# EAGLE design %_parasit (EAGLE 7.3.0)
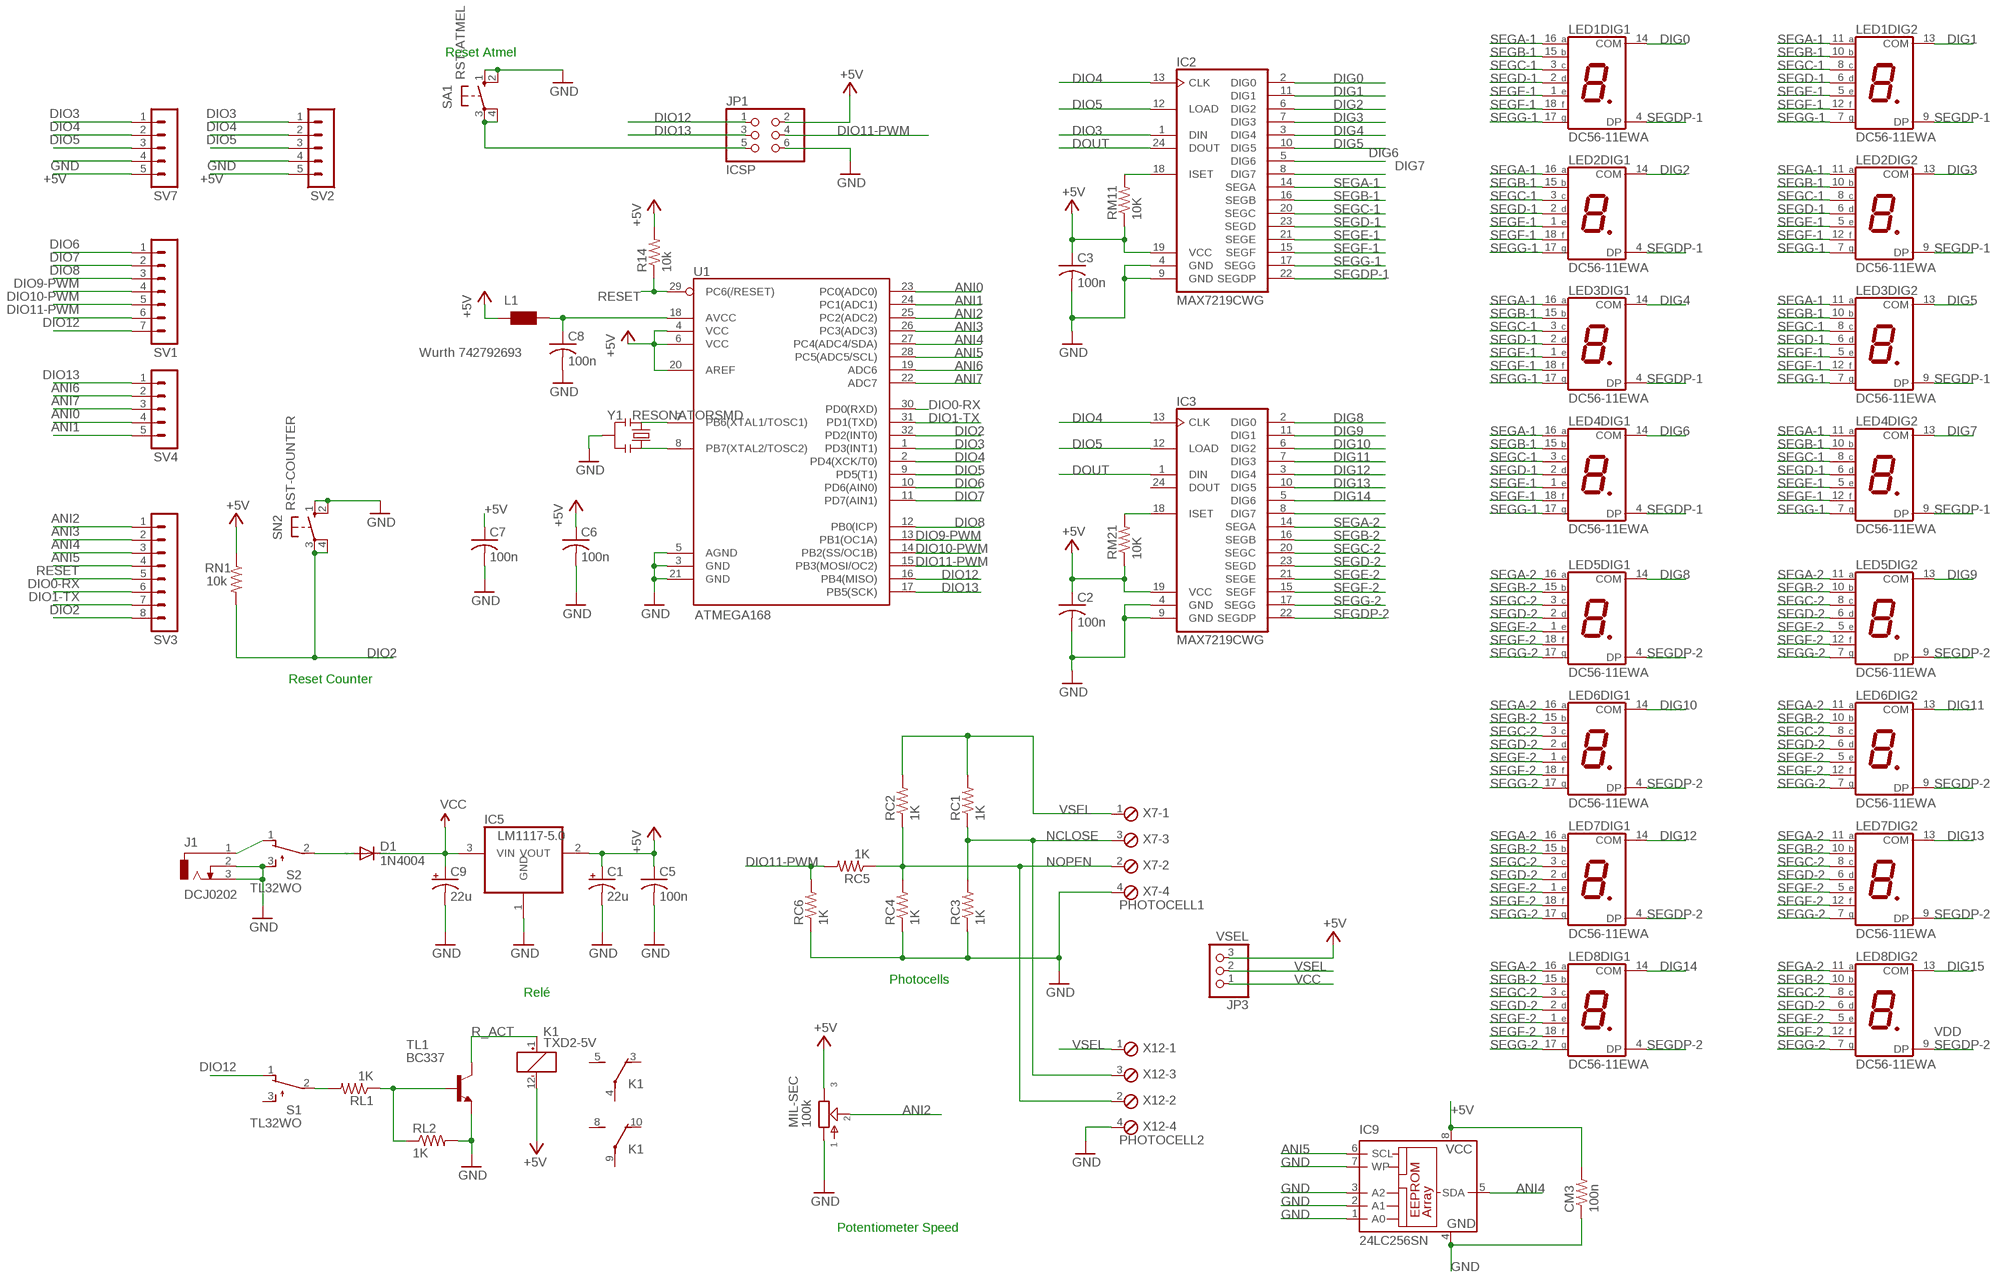
[diagram p0: schematic, sheet 1]

## Parts
C1  22u  CPOL-USC  [PANASONIC_C]
C2  100n  C-USC0603  [C0603]
C3  100n  C-USC0603  [C0603]
C5  100n  C-USC0603  [C0603]
C6  100n  C-USC0603  [C0603]
C7  100n  C-USC0603  [C0603]
C8  100n  C-USC0603  [C0603]
C9  22u  CPOL-USC  [PANASONIC_C]
CM3  100n  R-US_R0603  [R0603]
D1  1N4004  [DO41-10]
IC2  MAX7219CWG  [SO24W]
IC3  MAX7219CWG  [SO24W]
IC5  LM1117-5.0  REG1117  [SOT223]
IC9  24LC256SN  [SO-08]
J1  DCJ0202  [DCJ0202]
JP1  ICSP  PINHD-2X3  [2X03]
JP3  VSEL  PINHD-1X3  [1X03]
K1  TXD2-5V  [TXD2]
L1  WE-CBF_0603  [0603]
LED1  DC56-11EWA  [DA56]
LED2  DC56-11EWA  [DA56]
LED3  DC56-11EWA  [DA56]
LED4  DC56-11EWA  [DA56]
LED5  DC56-11EWA  [DA56]
LED6  DC56-11EWA  [DA56]
LED7  DC56-11EWA  [DA56]
LED8  DC56-11EWA  [DA56]
MIL-SEC  100k  16MM-PCB-BRACKETS  [16MM-PCB-BRACKETS@1]
R14  10k  R-US_R0603  [R0603]
RC1  1K  R-US_R0603  [R0603]
RC2  1K  R-US_R0603  [R0603]
RC3  1K  R-US_R0603  [R0603]
RC4  1K  R-US_R0603  [R0603]
RC5  1K  R-US_R0603  [R0603]
RC6  1K  R-US_R0603  [R0603]
RL1  1K  R-US_R0603  [R0603]
RL2  1K  R-US_R0603  [R0603]
RM11  10K  R-US_R0603  [R0603]
RM21  10K  R-US_R0603  [R0603]
RN1  10k  R-US_R0603  [R0603]
S1  TL32WO  [TL3XWO]
S2  TL32WO  [TL3XWO]
SA1  RST-ATMEL  10-XX  [B3F-10XX]
SN2  RST-COUNTER  10-XX  [B3F-10XX]
SV1  MA07-1  [MA07-1]
SV2  MA05-1  [MA05-1]
SV3  MA08-1  [MA08-1]
SV4  MA05-1  [MA05-1]
SV7  MA05-1  [MA05-1]
TL1  BC337  [TO92]
U1  ATMEGA168  [TQFP32-08]
X7  PHOTOCELL1  MPT4  [4POL254]
X12  PHOTOCELL2  MPT4  [4POL254]
Y1  RESONATORSMD  [RESONATOR-SMD]

## Nets
+5V [Power]: C1.+ C2.1 C3.1 C5.1 C6.1 C7.1 CM3.2 IC2.19(VCC) IC3.19(VCC) IC5.2(VOUT) IC9.8(VCC) JP1.2 JP3.3 K1.12(_:-) L1.1 MIL-SEC.3 R14.2 RM11.1 RM21.1 RN1.1 SV2.5 SV7.5 U1.4(VCC) U1.6(VCC) U1.20(AREF)
ANI0: SV4.4 U1.23(PC0(ADC0))
ANI1: SV4.5 U1.24(PC1(ADC1))
ANI2: MIL-SEC.2 SV3.1 U1.25(PC2(ADC2))
ANI3: SV3.2 U1.26(PC3(ADC3))
ANI4: IC9.5(SDA) SV3.3 U1.27(PC4(ADC4/SDA))
ANI5: IC9.6(SCL) SV3.4 U1.28(PC5(ADC5/SCL))
ANI6: SV4.2 U1.19(ADC6)
ANI7: SV4.3 U1.22(ADC7)
DIG0 [Leds]: IC2.2(DIG0) LED1.14(DIG1:COM)
DIG1 [Leds]: IC2.11(DIG1) LED1.13(DIG2:COM)
DIG2 [Leds]: IC2.6(DIG2) LED2.14(DIG1:COM)
DIG3 [Leds]: IC2.7(DIG3) LED2.13(DIG2:COM)
DIG4 [Leds]: IC2.3(DIG4) LED3.14(DIG1:COM)
DIG5 [Leds]: IC2.10(DIG5) LED3.13(DIG2:COM)
DIG6 [Leds]: IC2.5(DIG6) LED4.14(DIG1:COM)
DIG7 [Leds]: IC2.8(DIG7) LED4.13(DIG2:COM)
DIG8 [Leds]: IC3.2(DIG0) LED5.14(DIG1:COM)
DIG9 [Leds]: IC3.11(DIG1) LED5.13(DIG2:COM)
DIG10 [Leds]: IC3.6(DIG2) LED6.14(DIG1:COM)
DIG11 [Leds]: IC3.7(DIG3) LED6.13(DIG2:COM)
DIG12 [Leds]: IC3.3(DIG4) LED7.14(DIG1:COM)
DIG13 [Leds]: IC3.10(DIG5) LED7.13(DIG2:COM)
DIG14: IC3.5(DIG6) LED8.14(DIG1:COM)
DIG15: IC3.8(DIG7) LED8.13(DIG2:COM)
DIO0-RX: SV3.6 U1.30(PD0(RXD))
DIO1-TX: SV3.7 U1.31(PD1(TXD))
DIO2: RN1.2 SN2.3(P) SN2.4(P1) SV3.8 U1.32(PD2(INT0))
DIO3: IC2.1(DIN) SV2.1 SV7.1 U1.1(PD3(INT1))
DIO4: IC2.13(CLK) IC3.13(CLK) SV2.2 SV7.2 U1.2(PD4(XCK/T0))
DIO5: IC2.12(LOAD) IC3.12(LOAD) SV2.3 SV7.3 U1.9(PD5(T1))
DIO6: SV1.1 U1.10(PD6(AIN0))
DIO7: SV1.2 U1.11(PD7(AIN1))
DIO8: SV1.3 U1.12(PB0(ICP))
DIO9-PWM: SV1.4 U1.13(PB1(OC1A))
DIO10-PWM: SV1.5 U1.14(PB2(SS/OC1B))
DIO11-PWM: JP1.4 RC5.2 RC6.2 SV1.6 U1.15(PB3(MOSI/OC2))
DIO12: JP1.1 S1.1(O) SV1.7 U1.16(PB4(MISO))
DIO13: JP1.3 SV4.1 U1.17(PB5(SCK))
DOUT: IC2.24(DOUT) IC3.1(DIN)
GND: C1.- C2.2 C3.2 C5.2 C6.2 C7.2 C8.2 C9.- CM3.1 IC2.4(GND) IC2.9(GND) IC3.4(GND) IC3.9(GND) IC5.1(GND) IC9.1(A0) IC9.2(A1) IC9.3(A2) IC9.4(GND) IC9.7(WP) J1.2 J1.3 JP1.6 MIL-SEC.1 RC3.1 RC4.1 RC6.1 RL2.2 S2.3(S) SA1.1(S) SA1.2(S1) SN2.1(S) SN2.2(S1) SV2.4 SV7.4 TL1.1(E) U1.3(GND) U1.5(AGND) U1.21(GND) X7.4 X12.4 Y1.2
N$1: J1.1 S2.1(O)
N$2: D1.A S2.2(P)
N$4: RL1.2 S1.2(P)
N$8: RL1.1 RL2.1 TL1.2(B)
N$9: U1.7(PB6(XTAL1/TOSC1)) Y1.1
N$10: IC2.18(ISET) RM11.2
N$11: IC3.18(ISET) RM21.2
N$12: U1.8(PB7(XTAL2/TOSC2)) Y1.3
N$39: C8.1 L1.2 U1.18(AVCC)
NCLOSE: RC1.1 RC3.2 X7.3 X12.3
NOPEN: RC2.1 RC4.2 RC5.1 X7.2 X12.2
R_ACT: K1.1(_:+) TL1.3(C)
RESET: JP1.5 R14.1 SA1.3(P) SA1.4(P1) SV3.5 U1.29(PC6(/RESET))
SEGA-1: IC2.14(SEGA) LED1.11(DIG2:A) LED1.16(DIG1:A) LED2.11(DIG2:A) LED2.16(DIG1:A) LED3.11(DIG2:A) LED3.16(DIG1:A) LED4.11(DIG2:A) LED4.16(DIG1:A)
SEGA-2: IC3.14(SEGA) LED5.11(DIG2:A) LED5.16(DIG1:A) LED6.11(DIG2:A) LED6.16(DIG1:A) LED7.11(DIG2:A) LED7.16(DIG1:A) LED8.11(DIG2:A) LED8.16(DIG1:A)
SEGB-1: IC2.16(SEGB) LED1.10(DIG2:B) LED1.15(DIG1:B) LED2.10(DIG2:B) LED2.15(DIG1:B) LED3.10(DIG2:B) LED3.15(DIG1:B) LED4.10(DIG2:B) LED4.15(DIG1:B)
SEGB-2: IC3.16(SEGB) LED5.10(DIG2:B) LED5.15(DIG1:B) LED6.10(DIG2:B) LED6.15(DIG1:B) LED7.10(DIG2:B) LED7.15(DIG1:B) LED8.10(DIG2:B) LED8.15(DIG1:B)
SEGC-1: IC2.20(SEGC) LED1.3(DIG1:C) LED1.8(DIG2:C) LED2.3(DIG1:C) LED2.8(DIG2:C) LED3.3(DIG1:C) LED3.8(DIG2:C) LED4.3(DIG1:C) LED4.8(DIG2:C)
SEGC-2: IC3.20(SEGC) LED5.3(DIG1:C) LED5.8(DIG2:C) LED6.3(DIG1:C) LED6.8(DIG2:C) LED7.3(DIG1:C) LED7.8(DIG2:C) LED8.3(DIG1:C) LED8.8(DIG2:C)
SEGD-1: IC2.23(SEGD) LED1.2(DIG1:D) LED1.6(DIG2:D) LED2.2(DIG1:D) LED2.6(DIG2:D) LED3.2(DIG1:D) LED3.6(DIG2:D) LED4.2(DIG1:D) LED4.6(DIG2:D)
SEGD-2: IC3.23(SEGD) LED5.2(DIG1:D) LED5.6(DIG2:D) LED6.2(DIG1:D) LED6.6(DIG2:D) LED7.2(DIG1:D) LED7.6(DIG2:D) LED8.2(DIG1:D) LED8.6(DIG2:D)
SEGDP-1: IC2.22(SEGDP) LED1.4(DIG1:DP) LED1.9(DIG2:DP) LED2.4(DIG1:DP) LED2.9(DIG2:DP) LED3.4(DIG1:DP) LED3.9(DIG2:DP) LED4.4(DIG1:DP) LED4.9(DIG2:DP)
SEGDP-2: IC3.22(SEGDP) LED5.4(DIG1:DP) LED5.9(DIG2:DP) LED6.4(DIG1:DP) LED6.9(DIG2:DP) LED7.4(DIG1:DP) LED7.9(DIG2:DP) LED8.4(DIG1:DP) LED8.9(DIG2:DP)
SEGE-1: IC2.21(SEGE) LED1.1(DIG1:E) LED1.5(DIG2:E) LED2.1(DIG1:E) LED2.5(DIG2:E) LED3.1(DIG1:E) LED3.5(DIG2:E) LED4.1(DIG1:E) LED4.5(DIG2:E)
SEGE-2: IC3.21(SEGE) LED5.1(DIG1:E) LED5.5(DIG2:E) LED6.1(DIG1:E) LED6.5(DIG2:E) LED7.1(DIG1:E) LED7.5(DIG2:E) LED8.1(DIG1:E) LED8.5(DIG2:E)
SEGF-1: IC2.15(SEGF) LED1.12(DIG2:F) LED1.18(DIG1:F) LED2.12(DIG2:F) LED2.18(DIG1:F) LED3.12(DIG2:F) LED3.18(DIG1:F) LED4.12(DIG2:F) LED4.18(DIG1:F)
SEGF-2: IC3.15(SEGF) LED5.12(DIG2:F) LED5.18(DIG1:F) LED6.12(DIG2:F) LED6.18(DIG1:F) LED7.12(DIG2:F) LED7.18(DIG1:F) LED8.12(DIG2:F) LED8.18(DIG1:F)
SEGG-1: IC2.17(SEGG) LED1.7(DIG2:G) LED1.17(DIG1:G) LED2.7(DIG2:G) LED2.17(DIG1:G) LED3.7(DIG2:G) LED3.17(DIG1:G) LED4.7(DIG2:G) LED4.17(DIG1:G)
SEGG-2: IC3.17(SEGG) LED5.7(DIG2:G) LED5.17(DIG1:G) LED6.7(DIG2:G) LED6.17(DIG1:G) LED7.7(DIG2:G) LED7.17(DIG1:G) LED8.7(DIG2:G) LED8.17(DIG1:G)
VCC: C9.+ D1.C IC5.3(VIN) JP3.1
VSEL: JP3.2 RC1.2 RC2.2 X7.1 X12.1
Unconnected: IC3.24(DOUT) K1.3(O) K1.4(P) K1.5(S) K1.8(S) K1.9(P) K1.10(O) S1.3(S)

## Notes on the sheet
- Reset Atmel
- Wurth 742792693
- Reset Counter
- Photocells
- Relé
- Potentiometer Speed

## Library data of the parts
C1 C9 = rcl:CPOL-US: POLARIZED CAPACITOR, American symbol
C2 C3 C5-C8 = rcl:C-US: CAPACITOR, American symbol
CM3 RC6 RL1 RL2 = resistor:R-US_: RESISTOR, American symbol
D1 = diode:1N4004: DIODE general purpose rectifier, 1 A
IC2 IC3 = maxim-5:MAX7219*: Serially Interfaced, 8-Digit LED Display Drivers
IC5 = og-vreg:REG1117: 800mA and 1A Low Dropout (LDO) Positive Regulator 1.8V, 2.5V, 2.85V, 3.3V, 5V, and Adj
IC9 = microchip:24*: Serial EEPROM I2C; MF: MICROCHIP; MPN: 24LC256-I/SN; OC_FARNELL: 9757996; OC_NEWARK: 27C9144
J1 = con-jack:DCJ0202: DC POWER JACK Source: DCJ0202.pdf; OC_FARNELL: unknown; OC_NEWARK: unknown
JP1 = pinhead:PINHD-2X3: PIN HEADER
JP3 = pinhead:PINHD-1X3: PIN HEADER
K1 = relay:TX?-*: TX Relais NAiS TX-D RELAYS HIGH INSULATION Conforming to the supplementary insulation class of EN Standards (EN41003) Source: http://www.mew-europe.com/.. en_ds_61022_0007.pdf TX-S RELAYS SMALL POLARIZED RELAY WITH HIGH SENSITIVITY 50mW Source: http://www.mew-europe.com/.. en_ds_61022_0022.pdf; MPN: TXD2-5V; OC_FARNELL: unknown; OC_NEWARK: 13P9525
L1 = wuerth-elektronik:WE-CBF: SMD EMI Suppression Ferrite Beads - excellent anti-EMI properties - low DCR - impedances till 3000 ohms - rated current up to 6 A
LED1-LED8 = display-kingbright:DC56-11: 14.22mm (0.56INCH) DUAL DIGIT NUMERIC DISPLAYS Source: www.kingbright.com .. DA56-11SRWA.pdf; OC_FARNELL: unknown; OC_NEWARK: unknown
MIL-SEC = gm-pots:16MM-PCB-BRACKETS
R14 RC1-RC5 RM11 RM21 RN1 = rcl:R-US_: RESISTOR, American symbol
S1 S2 = switch:TL32WO: TINY SWITCH ON - MOM Source: http://www2.produktinfo.conrad.com/datenblaetter/700000-724999/705152-da-01-de-Subminiaturschalter_TL_36WO.pdf
SA1 SN2 = switch-omron:10-XX: OMRON SWITCH; MPN: B3F-1000; OC_FARNELL: 176432; OC_NEWARK: 36M3542
SV1 = con-lstb:MA07-1: PIN HEADER; OC_FARNELL: unknown; OC_NEWARK: unknown
SV2 SV4 SV7 = con-lstb:MA05-1: PIN HEADER; OC_FARNELL: unknown; OC_NEWARK: unknown
SV3 = con-lstb:MA08-1: PIN HEADER; OC_FARNELL: unknown; OC_NEWARK: unknown
TL1 = transistor:BC337: NPN TRANSISTOR
U1 = SparkFun:ATMEGA168
X7 X12 = con-phoenix-254:MPT4: PHOENIX CONNECTOR; OC_FARNELL: unknown; OC_NEWARK: unknown
Y1 = SparkFun:RESONATOR: Resonator Small SMD resonator. This is the itty bitty 10/20MHz resonators with built in caps. CSTCE10M0G55 and CSTCE20M0V53. Footprint has been reviewed closely but hasn't been tested yet.

## Net classes
1 Leds: width 0.152 mm, drill 0.508 mm, clearance 0.203 mm
2 Power: width 0.152 mm, drill 0.508 mm, clearance 0.203 mm
3 Ground Plane: width 0.152 mm, drill 0.508 mm, clearance 0.203 mm

## Board
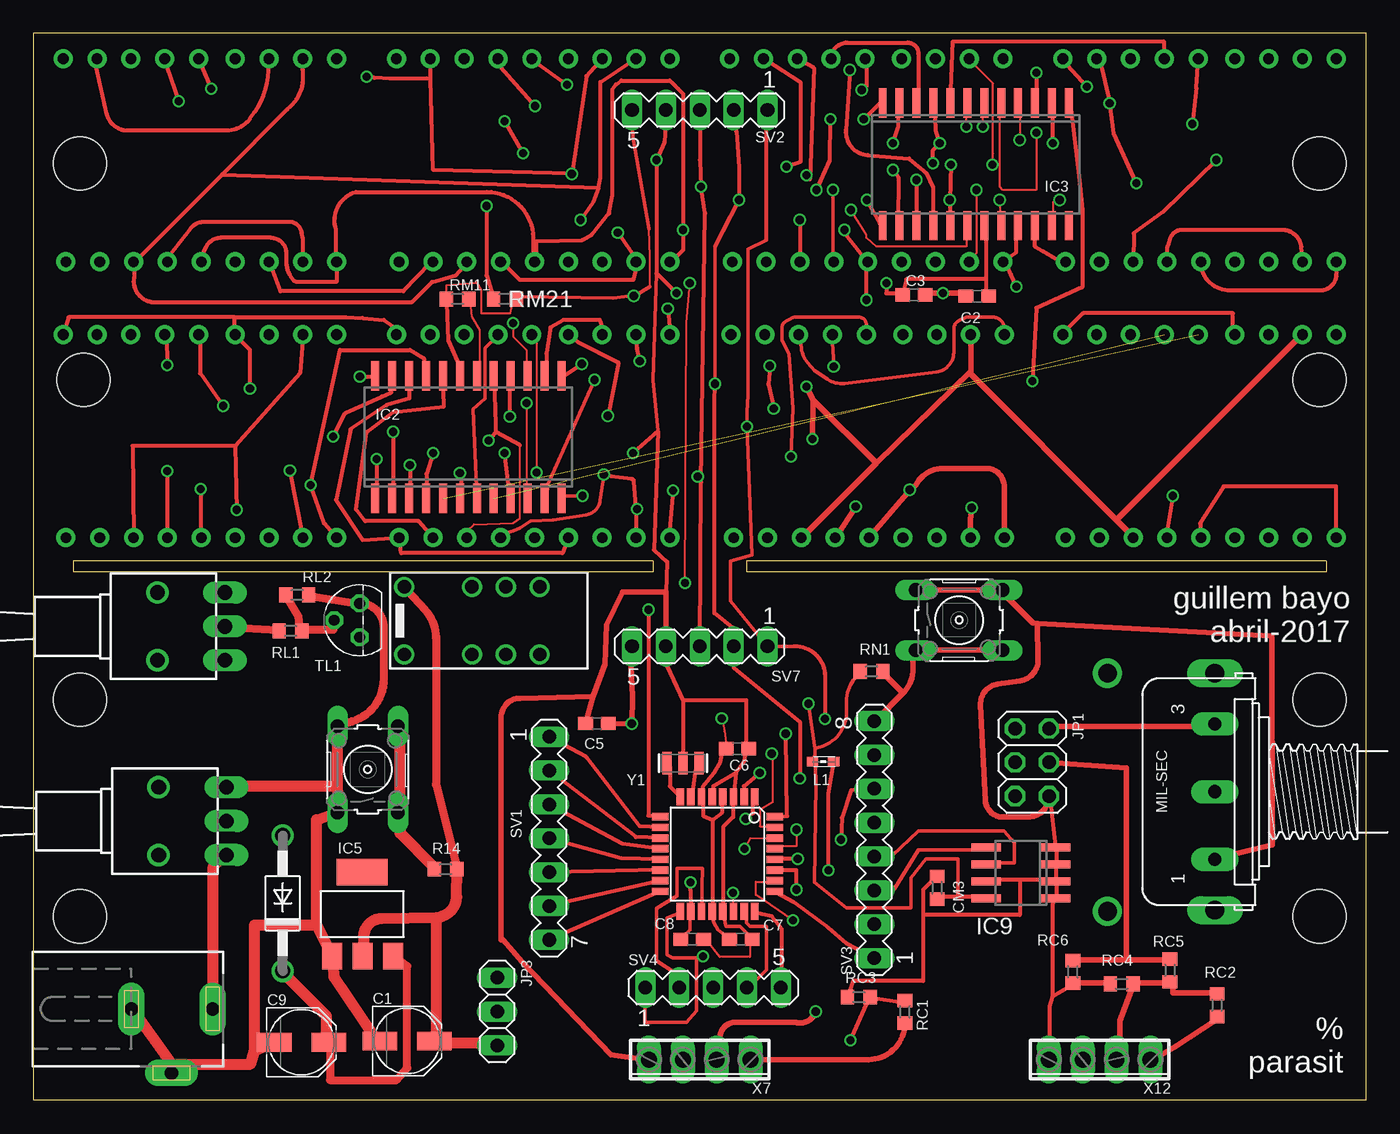
[diagram p1: board, top side]
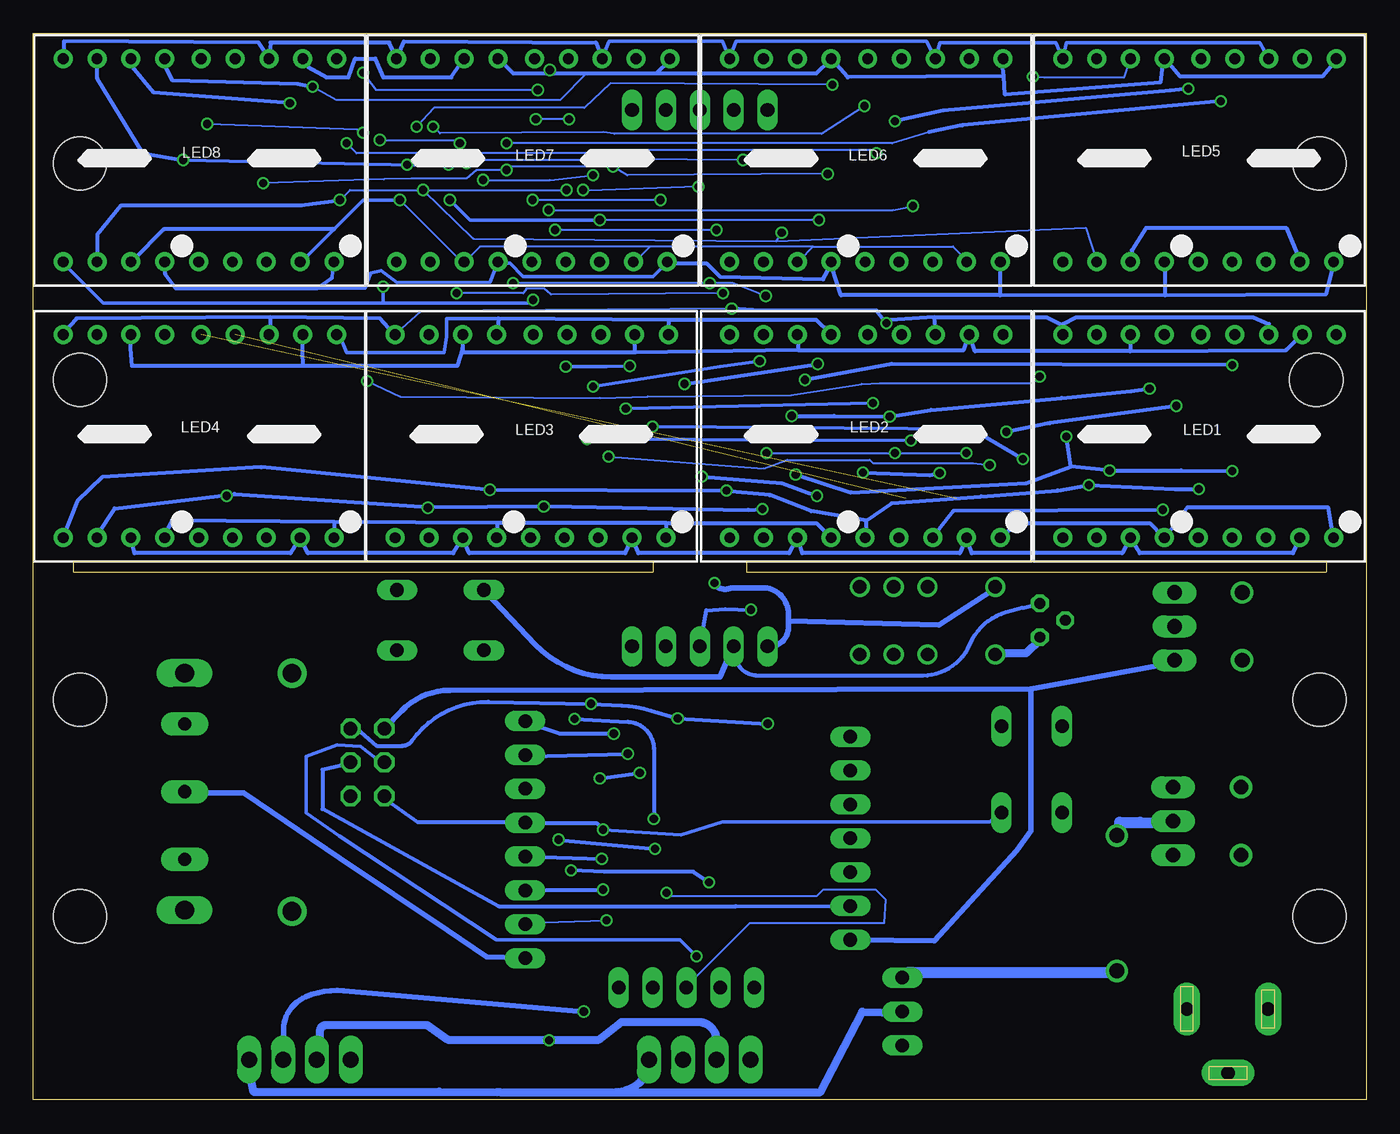
[diagram p2: board, bottom side, seen from below]

Size 100 x 80 mm. Coordinates in mm from the lower left corner, seen from the top.
Outline: 0,0 100,0 100,80 0,80 0,0
Outline: 46.5,39.6 3,39.6 3,40.4 46.5,40.4 46.5,39.6
Outline: 97,39.6 53.5,39.6 53.5,40.4 97,40.4 97,39.6
Copper layers (1*16): Top 0.035mm / dielectric 1.5mm / Bottom 0.035mm
Design rules "default *": minimum track width 6mil, minimum drill 24mil, track to track 8mil, track to pad 8mil, pad to pad 8mil, via to via 8mil, smd to smd 8mil, copper to edge 40mil, drill to drill 8mil, minimum pad ring 10mil, minimum via ring 4mil, stop-mask expansion 4mil, vias tented up to drill 0mil, thermal gap 10mil
Holes 4 mm at 3.5,70.25 96.5,70.25 3.75,54 96.5,54 3.5,13.75 96.5,13.75 96.5,30 3.5,30

### Footprints (pad centres in the part's own frame; a part is rotated, then mirrored left to right if it is on the bottom)
PANASONIC_C = smd 2.6 x 1.4: + 2.05,0; - -2.05,0
C0603 = smd 1.1 x 1: 1 -0.85,0; 2 0.85,0
R0603 = smd 1 x 1.1: 1 -0.85,0; 2 0.85,0
DO41-10 = drill 1.118: A 5.08,0; C -5.08,0
SO24W = smd 0.6 x 2.2: 1 -6.985,-4.6; 2 -5.715,-4.6; 3 -4.445,-4.6; 4 -3.175,-4.6; 5 -1.905,-4.6; 6 -0.635,-4.6; 7 0.635,-4.6; 8 1.905,-4.6; 9 3.175,-4.6; 10 4.445,-4.6; 11 5.715,-4.6; 12 6.985,-4.6; 13 6.985,4.6; 14 5.715,4.6; 15 4.445,4.6; 16 3.175,4.6; 17 1.905,4.6; 18 0.635,4.6; 19 -0.635,4.6; 20 -1.905,4.6; 21 -3.175,4.6; 22 -4.445,4.6; 23 -5.715,4.6; 24 -6.985,4.6
SOT223 = smd 1.499 x 2.007: 1 -2.261,-3.15; 2 0.025,-3.15; 3 2.311,-3.15 | smd 3.81 x 2.007: 4 0,3.15
SO-08 = smd 0.6 x 2.2: 1 -1.905,-2.6; 2 -0.635,-2.6; 3 0.635,-2.6; 4 1.905,-2.6; 5 1.905,2.6; 6 0.635,2.6; 7 -0.635,2.6; 8 -1.905,2.6
DCJ0202 = drill 1 pad 2 long: 1 0,3.1; 2 4.8,0; 3 0,-3
2X03 = drill 1.016 octagon: 1 -2.54,-1.27; 2 -2.54,1.27; 3 0,-1.27; 4 0,1.27; 5 2.54,-1.27; 6 2.54,1.27
1X03 = drill 1.016 long: 1 -2.54,0; 2 0,0; 3 2.54,0
TXD2 = drill 1: 1 -6.35,-2.54; 3 -1.27,-2.54; 4 1.27,-2.54; 5 3.81,-2.54; 8 3.81,2.54; 9 1.27,2.54; 10 -1.27,2.54; 12 -6.35,2.54
0603 = smd 0.85 x 0.7: 1 -0.9,0; 2 0.7,0
DA56 = drill 0.8 pad 1.422: 1 -10.26,-7.62; 2 -7.72,-7.62; 3 -5.18,-7.62; 4 -2.64,-7.62; 5 -0.1,-7.62; 6 2.44,-7.62; 7 4.98,-7.62; 8 7.52,-7.62; 9 10.06,-7.62; 10 10.26,7.62; 11 7.72,7.62; 12 5.18,7.62; 13 2.64,7.62; 14 0.1,7.62; 15 -2.64,7.62; 16 -5.18,7.62; 17 -7.72,7.62; 18 -10.26,7.62
16MM-PCB-BRACKETS@1 = drill 1 pad 1.778 long: 1 5.08,-0.254; 2 0,-0.254; 3 -5.08,-0.254 | drill 1.4 pad 1.778 long: 4 -8.89,-0.254; 5 8.89,-0.254 | drill 1.4 pad 2.184: 6 -8.89,-8.31; 7 8.983,-8.31
TL3XWO = drill 1.1 pad 1.422 long: 1 -2.54,-5.08; 2 0,-5.08; 3 2.54,-5.08 | drill 1.1 pad 1.676: M1 -2.54,0; M2 2.54,0
B3F-10XX = drill 1.016 long: 1 -3.251,2.261; 2 3.251,2.261; 3 -3.251,-2.261; 4 3.251,-2.261
MA07-1 = drill 1.016 long: 1 -7.62,0; 2 -5.08,0; 3 -2.54,0; 4 0,0; 5 2.54,0; 6 5.08,0; 7 7.62,0
MA05-1 = drill 1.016 long: 1 -5.08,0; 2 -2.54,0; 3 0,0; 4 2.54,0; 5 5.08,0
MA08-1 = drill 1.016 long: 1 -8.89,0; 2 -6.35,0; 3 -3.81,0; 4 -1.27,0; 5 1.27,0; 6 3.81,0; 7 6.35,0; 8 8.89,0
TO92 = drill 0.813 octagon: 1 1.27,0; 2 0,1.905; 3 -1.27,0
TQFP32-08 = smd 1.27 x 0.559: 1 -4.293,2.8; 2 -4.293,2; 3 -4.293,1.2; 4 -4.293,0.4; 5 -4.293,-0.4; 6 -4.293,-1.2; 7 -4.293,-2; 8 -4.293,-2.8; 17 4.293,-2.8; 18 4.293,-2; 19 4.293,-1.2; 20 4.293,-0.4; 21 4.293,0.4; 22 4.293,1.2; 23 4.293,2; 24 4.293,2.8 | smd 0.559 x 1.27: 9 -2.8,-4.293; 10 -2,-4.293; 11 -1.2,-4.293; 12 -0.4,-4.293; 13 0.4,-4.293; 14 1.2,-4.293; 15 2,-4.293; 16 2.8,-4.293; 25 2.8,4.293; 26 2,4.293; 27 1.2,4.293; 28 0.4,4.293; 29 -0.4,4.293; 30 -1.2,4.293; 31 -2,4.293; 32 -2.8,4.293
4POL254 = drill 1.2 long: 1 -3.81,0; 2 -1.27,0; 3 1.27,0; 4 3.81,0
RESONATOR-SMD = smd 0.7 x 1.7: 1 -1.2,0; 2 0,0; 3 1.2,0

### Placement (x,y rotation side)
C1  28.04,4.4 0 top
C2  70.82,60.28 180 top
C3  66.07,60.38 0 top
C5  42.28,28.22 180 top
C6  52.83,26.32 0 top
C7  53.08,12.02 0 top
C8  49.43,12.02 0 top
C9  20.12,4.3 0 top
CM3  67.8,15.9 270 top
D1  18.71,14.73 90 top
IC2  32.64,49.71 0 top
IC3  70.71,70.17 180 top
IC5  24.67,13.91 0 top
IC9  74.1,17 90 top
J1  10.36,6.8 270 top
JP1  74.93,25.3 270 top
JP3  34.8,6.6 270 top
K1  34.18,35.93 0 top
L1  59.35,25.34 0 top
LED1  12.5,49.77 0 bottom
LED2  37.5,49.77 0 bottom
LED3  62.6,49.77 0 bottom
LED4  87.5,49.77 0 bottom
LED5  12.5,70.47 0 bottom
LED6  37.5,70.47 0 bottom
LED7  62.5,70.47 0 bottom
LED8  87.5,70.47 0 bottom
MIL-SEC  88.9,23.1 270 top
R14  30.93,17.28 0 top
RC1  65.39,6.58 270 top
RC2  88.81,7.08 270 top
RC3  61.93,7.68 0 top
RC4  81.65,8.68 0 top
RC5  85.27,9.68 90 top
RC6  77.99,9.58 90 top
RL1  19.29,35.16 180 top
RL2  19.81,37.86 0 top
RM11  31.83,60.06 0 top
RM21  35.38,60.06 180 top
RN1  62.89,32.12 0 top
S1  9.3,35.5 90 top
S2  9.4,20.89 90 top
SA1  25.09,24.77 90 top
SN2  69.46,35.97 0 top
SV1  38.7,19.6 270 top
SV2  50,74.25 180 top
SV3  63.1,19.5 90 top
SV4  51,8.4 0 top
SV7  50,34 180 top
TL1  24.48,35.96 90 top
U1  51.33,18.42 270 top
X7  50,3 180 top
X12  80,3 180 top
Y1  48.74,25.24 180 top

### Tracks (layer width: path | path; a pad name or v marks a point on that pad's centre or on a via)
+5V  (via drill 0.61)
  Top 0.152: 71.5,60.5 C2.1 | 71.45,65.6 IC3.19 | 65.25,60.5 C3.1 65,60.5 | 31.05,59.75 31,60 RM11.1 31,60.25 31,61.1 33.25,61.3 33.6,60.75 33.6,59 35.8,59 36,60 RM21.1 36.25,60.25 | 32,55 32,54.5 IC2.19 | 46.2,65.3 46.25,63.25 46.25,61 | 30.25,4.5 C1.+ 30.5,4.25 | 24.75,11 IC5.2 | 44.75,34 SV7.5 | 31.75,17.5 R14.2 | 69.35,15.3 68,15.25 CM3.2 | 71.5,15.25 IC9.8 | 51.75,26.25 C6.1 52,26.5 51.85,27.65 v51.65,28.6 | 50.25,22.75 U1.6 50.25,22.5 | 50.95,14.25 U1.20 51,14 | 51.7,22.5 U1.4 | 76.25,28 JP1.2 | 58.65,26.3 58.65,26.35 L1.1 | v49.25,61.25 49,58.3 v48.9,38.75 | 52,12.25 C7.1 | 62,32 RN1.1 | 34.75,4.25 JP3.3
  Top 0.254: 46.2,65.3 45,72.15 44.9,73.45 SV2.5 | 45.2,60.35 43.5,60.15 36.25,60.25 | 45.2,60.35 46.25,61 | 45.2,60.35 v45.05,60.3 | 69.35,15.3 69.35,18.05 66.95,18.05 65.85,16.65 65.85,14.4 61,14.4 58.6,16.3 58.7,23.7 58.65,26.35 59.06,26.46 arc75 61,29.02 61,29.89 arc-42 61.68,31.64 62,32 | v58.15,29.7 58.65,26.3 | 52,12.25 51.35,12.75 51.05,13.25 51,13.5 51,14
  Top 0.305: 71.5,60.5 71.45,60.75 71.45,61.55 | 71.45,65.6 71.45,61.55 | 65.25,60.5 65.5,61.55 71.45,61.55 | 31.05,59.75 31.15,56.95 32,55 | 65,60.5 64,60.5 v64,61.25 | 68,15.25 71.5,15.25 | 51.75,26.25 51.55,25.35 51.05,24.5 50.25,23.5 50.25,22.75 | 50.95,21 50.25,21.3 50.25,22.5 | 50.95,21 50.95,14.25 | 51.7,22.5 51.7,21.55 50.95,21
  Top 0.406: 44.75,34 44.95,30.3 v44.9,28.2 C5.1 | 76.25,28 88.5,28 MIL-SEC.3
  Top 0.61: 31.75,17.5 30.21,23.62 arc-14 30.2,23.68 30.2,34.67 arc43 29.4,36.72 28,38.25 K1.12
  Top 0.813: 30.25,13.65 30.63,13.75 arc75 31.76,15.21 R14.2 | 30.25,4.5 30.25,13.65 | 30.25,13.65 26.13,13.57 arc88 24.77,12.22 24.75,11 | 30.5,4.25 34.75,4.25
  Bottom 0.152: v64,61.25 v49.25,61.25 47.5,61.25 v45.05,60.3 | 28,38.25 K1.12 | 76,27.75 JP1.2
  Bottom 0.305: 76,27.75 75.75,27.85 74.25,26.55 72.31,26.55 arc-55 71.59,26.92 arc56 65.86,29.84 v58.15,29.7 55.86,29.57 arc13 53.68,29.19 v51.65,28.6 v44.9,28.2
  Bottom 0.406: 28,38.25 32.05,35.6 43.35,35.9 | SV7.5 44.75,34 arc-90 43.35,35.4 43.35,35.9 | 43.35,35.9 43.35,36.45 arc-90 45.3,38.4 47.65,38.4 arc90 v48.9,38.75
ANI0
  Top 0.152: 53.5,14 U1.23
  Top 0.254: 53.5,14 53.5,13.25 53.75,13 55,13 55,9.75 53.75,8.5 SV4.4
ANI1
  Top 0.152: 54.25,14 U1.24
  Top 0.305: 54.25,14 54.7,13.9 55.4,13.75 56.15,12.8 56.15,9.35 56.1,8.5 SV4.5
ANI2
  Top 0.152: 55.75,15.5 U1.25
  Top 0.305: 55.75,15.5 57.05,14.8 59.65,12.9 61.05,11.7 62.8,10.75
  Top 0.406: 62.8,10.75 SV3.1
  Bottom 0.152: 63.35,10.65 SV3.1
  Bottom 0.406: MIL-SEC.2 88.5,23 84.2,23 77,18.1 68.9,12.7 66,10.7 63.35,10.65
ANI3  (via drill 0.61)
  Top 0.152: v57,13.45 54.2,15.35 54.2,16.35 55.5,16.35 U1.26
  Bottom 0.152: v57,13.45 63,13.25 SV3.2
ANI4  (via drill 0.61)
  Top 0.152: 55.75,17.2 U1.27 | 71.5,18.75 IC9.5 | 63.25,15.75 SV3.3
  Top 0.254: 71.5,18.75 66.4,18.75 64.6,15.8 63.25,15.75
  Top 0.305: 55.75,17.2 57.25,17.2 v57.25,15.75
  Bottom 0.152: 63,15.75 SV3.3
  Bottom 0.305: 63,15.75 v57.25,15.75
ANI5  (via drill 0.61)
  Top 0.152: 55.85,18.05 U1.28 | 71.5,17.75 IC9.6 | 63.25,18.25 SV3.4
  Top 0.254: 71.5,17.75 73.6,17.75 73.6,19.25 72.8,20.15 66.4,20.15 64.4,18.3 63.25,18.25
  Top 0.305: v57.35,18.05 55.85,18.05
  Bottom 0.152: 63,18.25 SV3.4
  Bottom 0.305: 63,18.25 v57.35,18.05
ANI6
  Top 0.152: 50.15,14.25 U1.19
  Top 0.254: 50.15,14.25 50.15,16 50.2,17.35 48.3,17.35 48.3,15.3 46.75,14.35 46.75,10.4 48.15,9.5 SV4.2
ANI7  (via drill 0.61)
  Top 0.152: 52.5,14 U1.22 52.5,14.25 v52.5,15.5
  Bottom 0.152: v52.5,15.5 52.25,15.25 41.25,15.25 40.75,15.75 36.8,15.75 36.05,15 36.15,13.25 46.25,13.25 51,8.5 SV4.3
DIG0  (via drill 0.61)
  Top 0.152: 27,45.25 IC2.2
  Top 0.305: v27,50.1 27,45.25 | v14.25,52.05 12.5,54.5 12.5,57.25 LED1.14
  Bottom 0.305: v27,50.1 23.75,50.75 v14.25,52.05
DIG1  (via drill 0.61)
  Top 0.152: 38.5,45.25 IC2.11
  Top 0.254: 38.5,45.25 38.6,46.2 v42.1,54
  Top 0.305: v10.05,55.1 10,57.25 LED1.13
  Bottom 0.305: v42.1,54 35.6,55.2 v10.05,55.1
DIG2  (via drill 0.61)
  Top 0.152: 32.1,46.3 32.15,45.25 IC2.6 | v37.75,47.05 37.75,57 37.5,57.25 LED2.14
  Top 0.305: v32,47 32.1,46.3
  Bottom 0.305: v32,47 32.75,46.85 v37.75,47.05
DIG3
  Top 0.254: IC2.7 33,51.8 33.9,52.6 33.9,56.4 LED2.13
DIG4  (via drill 0.61)
  Top 0.152: 28.25,45.25 IC2.3
  Top 0.254: v56.85,48.25 57,51.9 56.7,55.95 56.19,56.9 arc-20 56.15,57.11 56.15,57.81 arc-62 56.54,58.46 56.83,58.61 arc-28 57.19,58.7 61.92,58.7 arc-90 62.5,58.12 LED3.14
  Top 0.305: v28.25,47.6 28.25,45.25
  Bottom 0.152: v28.25,47.6 29.5,47.75 37,47.75 37.25,48 43.45,48 45.2,47.35 v56.85,48.25
DIG5  (via drill 0.61)
  Top 0.152: v37,52.25 37,45.25 IC2.10
  Top 0.254: v60.05,55 59.95,56.85 LED3.13
  Top 0.305: v55.55,51.85 55.15,53.65 v55.25,55.05
  Bottom 0.254: v55.55,51.85 v37,52.25 | v55.25,55.05 57,55 v60.05,55
DIG6  (1 unrouted)
DIG7  (1 unrouted)
DIG8  (via drill 0.61)
  Top 0.152: 76.5,74.75 IC3.2
  Top 0.305: v76.5,71.75 76.5,74.75 | v35.35,73.4 v36.75,71 | v13.35,75.85 12.5,77.8 LED5.14
  Bottom 0.152: v76.5,71.75 75.75,71 57.5,71 57.25,71.25 37,71.25 v36.75,71
  Bottom 0.305: v35.35,73.4 31.75,74.2 14.7,75.7 v13.35,75.85
DIG9  (via drill 0.61)
  Top 0.152: 64.95,74.75 IC3.11
  Top 0.305: 64.95,74.75 64.9,73 v64.5,71.75 | v10.9,74.9 10,77.5 LED5.13
  Bottom 0.152: v64.5,71.75 35.55,71.75 32.8,72.6
  Bottom 0.305: 32.8,72.6 30.3,73.1 v10.9,74.9
DIG10  (via drill 0.61)
  Top 0.152: v71.25,73 71.25,74.75 IC3.6 | 37.5,78 LED6.14
  Top 0.305: 37.5,78 v40.05,76.15
  Bottom 0.152: v71.25,73 69.95,74.4 58.65,74.4 56.7,76.25 v40.05,76.15
DIG11  (via drill 0.61)
  Top 0.152: v70,73 70,74.75 IC3.7
  Top 0.305: v37.65,74.55 35,77.5 LED6.13
  Bottom 0.152: v70,73 69.5,72.5 57.25,72.6 56.4,72.45 40.85,72.45 v37.65,74.55
DIG12  (via drill 0.61)
  Top 0.152: 75.25,75 IC3.3
  Top 0.305: v75.25,77.05 75.25,75 | v62.15,75.75 62.5,76 62.5,78 LED7.14
  Bottom 0.152: v75.25,77.05 74.25,75.75 v62.15,75.75
DIG13
  Top 0.305: LED7.13 arc-90 61.06,79.3 65.6,79.3 arc-90 66.4,78.5 66.4,75.5 arc90 66.27,75.36 IC3.10
DIG14  (via drill 0.61)
  Top 0.152: v75.25,72.55 75.25,68.25 72.75,68.25 72.5,68.5 72.5,74.75 IC3.5
  Top 0.305: v86.95,73.2 87.25,75.9 LED8.14
  Bottom 0.152: v75.25,72.55 75.7,72.8 v86.95,73.2
DIG15
  Top 0.305: IC3.8 69,79.4 84.8,79.4 LED8.13
DIO0-RX  (via drill 0.61)
  Top 0.152: v53.35,18.8 53.8,19.6 U1.30
  Top 0.305: v60.6,19.5 60.65,21.15 61.35,23.2 63,23.25 SV3.6
  Bottom 0.305: v60.6,19.5 v53.35,18.8
DIO1-TX  (via drill 0.61)
  Top 0.152: v55.4,25.95 55.45,25.6 55.45,22.3 54.5,21.75 54.5,20.5 55.5,20.5 U1.31
  Bottom 0.152: 63,25.75 SV3.7
  Bottom 0.305: 63,25.75 v55.4,25.95
DIO2  (via drill 0.61)
  Top 0.152: 66.25,33.75 SN2.3 | 63.75,32 RN1.2
  Top 0.305: 63.25,28.5 SV3.8 | v56.45,27.45 56.55,21.25 U1.32
  Top 0.406: 65.25,30.5 arc45 66,32.31 66,33.5 SN2.3 | 65.25,30.5 63.25,28.5 | 66.25,33.75 72.5,33.75 SN2.4 | 65.25,30.5 63.75,32
  Bottom 0.305: 63,28.25 60.5,27.45 v56.45,27.45
  Bottom 0.406: 63,28.25 SV3.8
DIO3  (via drill 0.61)
  Top 0.152: 54,22.5 U1.1 | 25.75,45.25 IC2.1 | 55,74.25 SV2.1
  Top 0.254: SV7.1 52.3,37.4 52.3,40.4 53.9,40.85 v53.55,50.5 53.55,51.6 53.6,52.85 53.6,63.8 55,64.5
  Top 0.305: 54,22.5 54,21.5 v53.45,21.05 | v59.4,28.55 59.4,31.75 arc91 57.1,34.02 55.25,34 SV7.1 | v25.75,48.05 25.75,45.25 | 55,64.5 55,74.25
  Bottom 0.254: 29.6,50.3 v53.55,50.5
  Bottom 0.305: v59.4,28.55 55.38,28.35 arc87 53.45,26.31 v53.45,21.05 | 29.6,50.3 v25.75,48.05
DIO4  (via drill 0.61)
  Top 0.152: 63.5,65.75 IC3.13 | 53.3,22.75 U1.2 | 39.75,54.25 IC2.13
  Top 0.254: v51.15,53.7 51.15,64
  Top 0.305: v62.55,67.5 63.5,65.75 | SV2.2 52.75,72.65 52.95,69.9 v52.95,67.5 51.15,64 | 53.3,22.75 53.3,23.5 v54.5,24.5 | v57.5,24.1 57.5,28.35 52.55,32.4 SV7.2 52.5,35.4 51.1,36.5 51.1,52.25 v51.15,53.7 | v41.15,55.2 39.75,54.25
  Bottom 0.152: v52.95,67.5 v62.55,67.5
  Bottom 0.305: v57.5,24.1 v54.5,24.5 | v51.15,53.7 v41.15,55.2
DIO5  (via drill 0.61)
  Top 0.152: 63.5,74.75 IC3.12 | 47,21.25 U1.9 | 39.75,45.25 IC2.12
  Top 0.305: v62.3,73.55 63.5,74.75 | v59.8,73.55 59.75,70.5 v58.75,68.25 | SV2.3 50,70.5 v50.1,68.5 50.4,66.5 50.1,46.3 | v46.15,36.75 46.15,21.31 47,21.25 | v41.2,45.3 39.75,45.25 | SV7.3 50.1,46.3 | 50.1,46.3 v49.85,46.75
  Bottom 0.152: v59.8,73.55 v62.3,73.55 | v58.75,68.25 58.4,68.2 v50.1,68.5
  Bottom 0.305: v46.15,36.75 48.1,36.8 49.5,36.7 SV7.3 | v41.2,45.3 43.85,46.25 v49.85,46.75
DIO6
  Top 0.305: U1.10 45.5,20.5 41.5,25.7 SV1.1
DIO7
  Top 0.305: U1.11 45.2,19.7 SV1.2
DIO8
  Top 0.305: U1.12 44.2,19.2 SV1.3
DIO9-PWM
  Top 0.305: U1.13 44.1,18.1 SV1.4
DIO10-PWM
  Top 0.305: U1.14 SV1.5
DIO11-PWM
  Top 0.152: 78,10.5 RC6.2 | 85.25,10.5 RC5.2
  Top 0.305: U1.15 SV1.6
  Top 0.406: JP1.4 82,24.9 82,10.5 | 85.25,10.5 82,10.5 | 82,10.5 78,10.5
  Bottom 0.305: JP1.4 76,25.25 78.3,24.75 78.3,21.8 65.1,14.5 47.3,14.5 SV1.6
DIO12
  Top 0.305: U1.16 SV1.7
  Bottom 0.152: 14.5,32.75 S1.1 | 38.5,12 SV1.7
  Bottom 0.406: 25.15,30.8 68.76,30.7 arc-46 72.38,29.16 JP1.1 | 25.15,30.8 20.85,31.6 14.5,32.75 | 38.5,12 32.4,11.9 26.2,18.7 25.15,20.15 25.15,30.8
DIO13  (via drill 0.61)
  Top 0.152: 48.5,14 U1.17
  Top 0.254: 48.5,14 47.55,13.65 47.55,10.85 47.95,10.65 49.75,10.65 | 49.75,10.65 49.75,6.65 49,5.8 45.9,5.8 45.9,8.25 SV4.1 | v50.25,10.75 49.75,10.65
  Bottom 0.254: JP1.3 74.05,25.4 75.45,26.5 77.2,26.6 79.55,25.75 79.55,21.5 77.05,19.8 65.25,12 51.5,12 v50.25,10.75
DOUT  (via drill 0.61)
  Top 0.152: 25.5,54.25 IC2.24 | 77.8,74.65 IC3.1
  Top 0.305: v24.5,54.25 25.5,54.25 | v74.95,53.9 75.25,59.4 78.7,60.95 78.7,66.75 78.5,68.65 77.8,74.65
  Bottom 0.152: v24.5,54.25 25,53.75 36.5,53.75 37.85,53.7 43.15,52.85 53.9,52.75 57.5,52.65 72.5,52.75 v74.95,53.9
GND  (via drill 0.61)
  Top 0.152: 67.75,16.75 CM3.1 | 66.25,38.25 SN2.1 | 76.75,17.75 IC9.3 76.75,17.5 | 76.75,18.75 IC9.4 76.7,19 | 76.75,15.25 IC9.1 76.75,15 76.5,14.75 | 76.75,16.25 IC9.2 | 71.5,16.5 IC9.7 | 76.5,16.5 IC9.2 | 76.75,16.5 IC9.2 | 76.3,22.6 76.25,22.75 JP1.6 | 20.75,37.75 RL2.2 | 22.8,28 SA1.2 23,28.25 | 14.5,23.5 S2.3 | 22.5,10.75 IC5.1 | 16.6,3.65 18,4.25 C9.- | 22.75,21.5 SA1.1 | 48.7,25.45 Y1.2 | 47.5,34 SV7.4 | 53.5,26.25 C6.2 53.5,26.5 | 52.55,22.75 U1.3 52.5,22.5 | 51,22.75 U1.5 | 51.75,14.25 U1.21 51.75,14 | 29.5,45.25 IC2.4 | 35.75,45.25 IC2.9 | v74,72 74,74.75 IC3.4 | 67.65,74.75 IC3.9 | 67,60.5 C3.2 | 69.75,60.5 C2.2 | C8.2 50.5,12 51.5,10.7 53.75,10.7 53.75,12 C7.2 53.75,12.25 | 78,8.75 RC6.1 77.75,8.5 | 80.75,8.75 RC4.1 | 76.25,3 X12.4 | 35.25,12 35.1,12
  Top 0.254: 53.75,12.25 53,13 51.95,13 51.75,14 | 46.75,62 46.5,54 46.85,50.15
  Top 0.305: 67.75,16.75 66.75,15.75 66.75,13.85 | 72.5,38.25 SN2.2 | 76.75,18.75 76.75,17.75 | 76.75,16.25 76.75,15.25 | 76.5,16.5 74,16.5 | 74,16.5 71.5,16.5 | 76.75,16.5 76.75,17.5 | 76.7,19 76.3,22.6 | 88.6,18.05 MIL-SEC.1 | 48.7,25.45 48.75,26.4 48.75,29.95 | 48.75,29.95 47.55,32.55 47.5,34 | 53.5,26.25 53.35,25.4 52.75,24.55 | 52.55,22.75 52.75,24.55 | 51,22.75 51,23.5 52.75,24.55 | 51.75,14.25 51.75,20.45 52.5,21.2 52.5,22.5 | 48.75,29.95 53.5,29.95 53.5,26.5 | 29.5,45.25 29.5,46.95 v30,48.5 | 35.75,45.25 v35.35,48.5 | 67.65,74.75 67.7,72.7 v68,71.75 67.5,71.25 v67.5,70.25 | v48.25,60.5 46.75,62 v46.75,70.5 47.35,71.85 47.45,73.65 SV2.4 | v45,48.5 46.85,50.15 46.55,41.25 47.55,40.35 47.45,38.1 | RC3.1 61.5,8.9 66.75,8.9 66.75,13.85 | 76.5,7.75 76.25,7 76.25,3 | 76.5,7.75 77.75,8.5 | 76.5,7.75 76.5,14.75 | 66.75,13.85 74,13.85 74,16.5
  Top 0.406: 72.5,38.25 66.25,38.25 | 88.6,18.05 92.95,19.1 92.9,34.8 75.33,35.73 | 75.33,35.73 75.38,32.98 arc-83 74.03,31.41 72.38,31.19 arc85 71.07,29.61 71.44,22.41 arc87 72.72,21.2 74.64,21.2 arc90 JP1.6 | 75.33,35.73 75,35.75 72.75,38 SN2.2 | 42,30.25 42.9,32.7 43,35.6 44.2,38.1 47.45,38.1 47.45,37.6 SV7.4 | 69.75,60.5 v68.25,60.5 67,60.5 | 35.1,12 35.1,28.7 arc-90 36.5,30.1 42,30.25 | 42,30.25 C5.2 | 80.75,8.75 78,8.75 | 35.25,12 36.65,10.35 43.35,3.35 46,3 X7.4
  Top 0.61: 20.75,37.75 24.55,37.15 24.25,37.25 TL1.1 arc-90 26.3,35.41 26.3,31.55 arc-90 23,28.25 | 10.5,2 J1.2 | 7.5,6.75 J1.3
  Top 0.813: 22.8,28 22.8,23.5 | 22.8,23.5 22.9,21.45 SA1.1 | 22.8,23.5 14.5,23.5 | 22.5,10.75 22.55,9.2 25.75,4.5 C1.- | 16.6,3.65 16.3,2.65 10.4,2.65 | 10.5,2 10.4,2.65 | 10.4,2.65 7.5,6.75 | 21.25,13.1 16.6,13.1 16.6,3.65 | 16.6,3.65 C9.- | 22.75,21.5 21.25,21 21.25,13.1 | 21.25,13.1 IC5.1
  Bottom 0.152: v30,48.5 v35.35,48.5 v45,48.5 | v68,71.75 68.25,72 v74,72 | v68.25,60.5 63.25,60.5 63,60.85 61.7,60.85 61.15,60.4 v48.25,60.5 | v67.5,70.25 67.25,70.5 57.25,70.5 57,70.75 55.1,70.55 v46.75,70.5 | 66,38 SN2.1 | 47.5,34 SV7.4 47.45,33.1
  Bottom 0.305: 47.45,33.1 47.07,32.55 arc-55 45.64,31.8 33.28,31.8 arc-67 29.75,34.13 29.73,34.17 arc51 27.03,36.55 25.8,36.9 TL1.1
  Bottom 0.406: 66,38 62.34,34.16 arc-46 56.61,31.7 48.5,31.7 47.5,34
N$1
  Top 0.152: 14.25,18.25 S2.1
  Top 0.813: 14.25,18.25 13.5,17.5 13.5,7 J1.1
N$2
  Bottom 0.152: 14.5,20.75 S2.2
  Bottom 0.813: 14.5,20.75 16.95,20.8 18.5,20.8 D1.A
N$4
  Top 0.152: 14.5,35.5 14.5,35.45
  Top 0.61: 14.5,35.45 18.35,35.25 RL1.2 | 14.5,35.5 S1.2
N$8
  Top 0.152: 20.25,35.25 RL1.1 20,35.25 | 22.5,35.75 TL1.2 | 19,37.75 RL2.1
  Top 0.61: 20.25,35.25 22.5,35.25 22.5,35.75 | 19,37.75 19.9,36.25 20,35.25
N$9
  Top 0.305: U1.7 49.4,22.85 49.65,24.5 Y1.1
N$10
  Top 0.152: RM11.2 32.75,60 32.8,59.85 32.9,58.75 33.5,57.75 33.5,54.5 IC2.18
N$11  (via drill 0.61)
  Top 0.152: v61.35,66.75 62.5,64.9 62.5,64.65 63.25,64 70,64 70,65.5 IC3.18 | 34.5,60.25 RM21.2
  Top 0.305: 34.5,60.25 34,61.85 v34,67.05
  Bottom 0.152: v34,67.05 35.5,66.75 v61.35,66.75
N$12
  Top 0.152: 48.5,22.75 U1.8 | 47.75,25 Y1.3
  Top 0.305: 48.5,22.75 47.75,23.5 47.75,25
N$39  (via drill 0.61)
  Top 0.152: 48.75,12.25 C8.1 | 49.25,14 U1.18
  Top 0.254: 48.75,12.25 49.25,12.75 49.25,14
  Top 0.305: v59.65,17.2 59.65,22.95 L1.2 | v49.3,16.3 49.3,15.75 U1.18
  Bottom 0.305: v59.65,17.2 57.15,17.1 50.5,17.1 v49.3,16.3
NCLOSE  (via drill 0.61)
  Top 0.152: 63.3,7.55 RC3.2 | 65.25,7.25 RC1.1
  Top 0.305: 65.25,7.25 63.3,7.55 | v61.3,4.45 62.35,6.8 RC3.2
  Bottom 0.152: 48.5,3 X7.3
  Bottom 0.254: 61.55,4.5 arc-90 v61.3,4.45
  Bottom 0.61: X12.3 78.5,3 78.5,5.1 arc90 78,5.6 70.5,5.6 68.9,4.5 61.55,4.5 | X7.3 48.73,4.43 arc-90 50.1,5.8 55.9,5.8 57.65,4.45 v61.3,4.45
NOPEN  (via drill 0.61)
  Top 0.152: 82.5,8.75 RC4.2 82.5,8.5 | 85.25,8.75 RC5.1 85.5,8.75 | 88.75,8 RC2.1 | 81.5,3 X12.2
  Top 0.406: 85.25,8.75 82.5,8.75 | 88.75,8 85.5,8 85.5,8.75 | 82.5,8.5 81.5,5.9 81.5,3 | X7.2 51.3,3.2 51.5,4.6 arc-90 52.7,5.8 57.2,5.8 arc90 v58.7,6.6
  Bottom 0.406: X12.2 81.23,5.22 arc66 79.57,7.71 arc28 76.72,8.17 v58.7,6.6
R_ACT
  Bottom 0.61: TL1.3 24.5,34.5 25.5,33.5 27.75,33.5 K1.1
RESET  (via drill 0.61)
  Top 0.152: 30,17.5 R14.1 | 27.5,21.5 SA1.3 27.5,21.75 | 27.5,28 SA1.4 | v57.25,20.25 57.25,19 55.75,19 U1.29
  Top 0.813: 30,17.5 27.5,20 27.5,21.5 | 27.5,21.75 27.5,28
  Bottom 0.152: 27.5,21.5 SA1.3
  Bottom 0.254: 73.5,22.45 JP1.5 | 27.5,21.5 28.25,20.85 48.3,20.85 51.4,19.85 v57.25,20.25
  Bottom 0.305: v57.25,20.25 57.75,20.75 63,20.75 SV3.5 63.75,20.8 71.15,20.8 73.5,22.45
SEGA-1
  Top 0.152: 38.5,54.5 IC2.14
  Top 0.305: 38.5,54.5 38.5,56 38.8,57.95 39.75,58.5 42.5,58.5 42.7,58 LED2.16
  Bottom 0.152: 29.75,57.25 LED2.11 | 79.85,57.25 LED4.11 | 67.8,56.35 LED3.16
  Bottom 0.305: 17.7,56.15 6,56.25 5,57.25 LED1.11 | 17.7,56.15 17.7,57.35 LED1.16 | 29.75,57.25 29.35,56.15 17.7,56.15 | 54.85,56.05 54.85,57.25 LED3.11 | 42.65,56.25 54.85,56.05 | 42.65,56.25 42.65,57.05 LED2.16 | 54.85,56.05 67.75,56.05 67.75,57.25 LED3.16 | 79.75,55.05 79.85,57.25 | 79.75,55.05 68.2,55.05 67.8,56.35 | 79.75,55.05 92.6,55.05 92.7,56.35 LED4.16 | 42.65,56.25 30.2,56.25 29.9,57.15 LED2.11
SEGA-2  (via drill 0.61)
  Top 0.152: 64.85,65.85 IC3.14 | 29.8,78 LED6.11
  Top 0.305: LED8.11 80,78 v80.75,74.75 81.05,72.45 v82.75,68.75 | 64.85,65.85 64.9,69.2 v64.5,69.75 | v56.5,70 57.55,70.35 57.55,76.35 55,78 LED7.11 | LED5.16 17.65,77.23 arc-34 16.59,74.09 16.23,73.59 arc-54 14.51,72.7 7.08,72.7 arc-77 5.51,73.95 4.7,77.5 LED5.11 | 29.8,76.6 30,69.75 v40.4,69.45 41.5,76.8 LED6.16 | 29.8,76.6 29.8,78 | v25,76.75 25.6,76.65 26.75,76.6 29.8,76.6
  Bottom 0.152: 67.75,78 LED7.16 | v25,76.75 24.15,76.7 18.15,76.7 17.75,78 LED5.16 | v40.4,69.45 55.45,69.35 v56.5,70 64.25,70 v64.5,69.75 66.75,69.75 67.5,69.1 71.65,69.1 73.7,69.05 v82.75,68.75
  Bottom 0.305: 67.75,78 68.65,76.7 73.75,76.7 74.35,78.1 75.85,78.1 76.35,76.7 78,76.7 79.4,77.5 79.75,78 LED8.11 | v80.75,74.75 90.95,75.55 92.6,77.5 LED8.16
SEGB-1  (via drill 0.61)
  Top 0.152: 2.25,57.5 LED1.10 | 35.75,54.25 IC2.16 | 15.25,57.25 LED1.15
  Top 0.305: 2.25,57.5 2.65,58.7 15.1,58.7 | 15.1,58.7 15.1,57.5 LED1.15 | 15.1,58.7 23.45,58.7 24.7,58.65 26.3,58.5 27.3,57.8 LED2.10 | LED4.10 77.25,57.5 78.75,59 90,59 90,57.5 LED4.15 | v35.75,51.25 35.75,54.25 | v43.1,51.3 43.9,55.3 40.85,56.85 LED2.15 | 15.25,57.25 16.25,56.25 v16.25,53.35
  Bottom 0.152: 40.25,57.5 LED2.15
  Bottom 0.254: 65.1,58.6 69,58.6 69,57.25 69.2,56.05 76.5,56.05 77,57.25 LED4.10
  Bottom 0.305: v43.1,51.3 39.9,51.3 v35.75,51.25 32.65,51.75 22.85,52.65 17.65,53.15 v16.25,53.35 | 52.35,58.5 52.35,57.5 LED3.10 | 52.35,58.5 41.25,58.5 40.25,57.5 | 52.35,58.5 65.1,58.6 65.2,57.5 LED3.15
SEGB-2  (via drill 0.61)
  Top 0.152: 67.5,65.75 IC3.16
  Top 0.305: v79.05,76 77.25,78 LED8.10 | 67.5,65.75 67.5,68.45 67,69.5 65.7,70.6 62.59,70.86 arc-89 60.96,72.74 v61.25,77.25
  Bottom 0.152: 2.25,78 LED5.10 | 15,78 LED5.15 15.25,78 | v79.05,76 77.25,75 60.5,75 58.5,77 | 40.25,78 LED6.15
  Bottom 0.305: 2.25,78 3.25,76.8 14,76.8 15,78 | 27.2,76.8 27.1,75.4 15.45,76.3 15.25,78 | 27.2,76.8 27.3,77.7 LED6.10 | 27.2,76.8 38.9,76.7 40,78 LED6.15 | v79.05,76 80.15,76.2 89.6,76.5 90.1,77.5 LED8.15 | 61.5,77 64,77 65,78 LED7.15 | 53.25,77 52.25,78 LED7.10 | 61.5,77 58.5,77 53.25,77 | 61.5,77 v61.25,77.25 | 40.25,78 41.25,77 53.25,77
SEGC-1
  Top 0.305: LED2.8 28.9,43.4 24.9,43.4 24.2,44.3 25,50.1 27,51.6 30.8,52 IC2.20
  Bottom 0.305: LED1.8 5.5,41 17,41 LED1.3 18.3,41 29.6,41 LED2.8 30.5,41 42.3,41 LED2.3 43.3,41 54.6,41 LED3.8 55.6,41 67.3,41 LED3.3 68.5,41 79.4,41 LED4.8 80.7,41 92.4,41 LED4.3
SEGC-2  (via drill 0.61)
  Top 0.152: v72.5,67.5 72.5,65.75 IC3.20
  Top 0.305: LED5.3 17.75,62.75 18.55,60.65 27.75,60.65 29.75,62.75 LED6.8
  Bottom 0.152: v72.5,67.5 68,63 67.75,63 LED7.3 67.5,63 66.5,64 53.75,64 | 41.5,64 31,64 30,63 LED6.8 | 41.5,64 42.5,63 LED6.3 | 53.75,64 54.75,63 LED7.8 | 41.5,64 53.75,64
  Bottom 0.254: v72.5,67.5 75.25,67.5 77.45,65.3 79.75,63 LED8.8
  Bottom 0.305: 77.45,65.3 90.2,65.3 92.5,63 LED8.3 | LED5.8 5,63 6,65.4 16.5,65.4 17.6,63.7 LED5.3
SEGD-1  (via drill 0.61)
  Top 0.152: 26.85,54.25 IC2.23 | 45.25,42.25 LED2.2 | 60.25,42.25 LED3.6 | 85,42.35 LED4.6 | v45.3,44.3 45.25,44
  Top 0.254: v42.8,46.9 42.53,44.94 arc-74 41.46,43.86 39,43.5 37.3,43.4 36.5,42.9 36,42.65 35.15,42.45 LED2.6
  Top 0.305: 26.85,54.25 26.85,53.05 26.15,52.75 23.4,51.5 v22.5,49.75 | v19.25,47.2 20.25,42.25 LED1.2 | v10.05,47.15 10.05,42.55 LED1.6 | v42.8,46.9 43.35,46.75 44.88,46.57 arc-79 45.06,46.38 45.25,44 45.25,42.25 | v85.5,45.3 85,42.35
  Top 0.406: v61.7,44.5 60.25,42.25 | v70.4,44.4 70.3,43.55 LED3.2
  Bottom 0.152: 95.2,42.35 LED4.2 | 70.3,44.45 v70.4,44.4 | 84.9,45.45 v85.5,45.3 | 61.55,44.55 v61.7,44.5
  Bottom 0.305: 22.15,47.5 v19.25,47.2 13.9,47.2 v10.05,47.15 | 22.15,47.5 v22.5,49.75 | 95.2,42.35 93.9,44.35 84.9,45.45 70.3,44.45 61.55,44.55 46.35,44.25 v45.3,44.3 | 22.15,47.5 25.5,46.25 38.65,45.55 v42.8,46.9
SEGD-2  (via drill 0.61)
  Top 0.152: v77,67.5 76.5,67.35 76.5,65.75 IC3.23 | v70.75,68.25 70.75,63.5 70.25,63 LED7.2
  Top 0.254: v60,68.25 60,63 LED7.6
  Top 0.305: LED6.6 35.25,62.75 36.5,61.5 45,61.5 45.3,62.65 LED6.2 45.25,63 v43.85,65.05 | LED5.6 10.15,63.3 11.82,65.38 arc-51 12.8,65.85 19.19,65.85 arc-80 20.14,65.05 20.2,64.7 LED5.2 | LED8.6 85.05,63.72 arc-19 85.11,64.07 85.28,64.59 arc-72 86.2,65.25 93.71,65.25 arc-84 95.13,63.96 95.2,63.3 LED8.2
  Bottom 0.152: v70.75,68.25 76.25,68.25 v77,67.5 | v70.75,68.25 v60,68.25 | 44.25,64.4 67,64.6 v70.75,68.25 | 44.25,64.4 21.05,65.4 20.25,63 LED5.2 | 44.25,64.4 v43.85,65.05
  Bottom 0.305: v77,67.5 79.9,67.1 93.4,67.1 95.2,64.9 LED8.2
SEGDP-1
  Top 0.305: LED2.4 39.7,41 27.6,41 LED2.9 24.7,42 22.7,45 23.8,50.3 26.5,52.1 28.2,52.6 IC2.22
  Bottom 0.152: 2.5,42.25 LED1.9 | 15,42.25 LED1.4 15.25,42.25 | 40.25,42.25 LED2.4 | 52.5,42.25 LED3.9
  Bottom 0.305: 2.5,42.25 2.9,44.45 13.4,44.45 15,42.25 | 15.25,42.25 16.25,43.25 26.25,43.25 27.25,42.25 LED2.9 | 40.25,42.25 41.25,43.25 52.5,43.25 | 52.5,42.25 52.5,43.25 | 65.2,43.25 65.2,42.35 LED3.4 | 52.5,43.25 65.2,43.25 | 77.45,43.35 77.45,42.45 LED4.9 | 65.2,43.25 77.45,43.35 | 77.45,43.35 89.6,43.45 90.1,42.45 LED4.4
SEGDP-2
  Top 0.152: 75.15,65.6 IC3.22
  Top 0.305: 75.15,65.6 75.15,64 75.75,63.65 77.25,62.75 LED8.9
  Bottom 0.152: 40.1,62.45 LED6.4 | 65,62.75 LED7.4
  Bottom 0.254: 15.1,60.35 27.45,60.35 | 65,62.75 64.25,62.75 63.25,61.75 53.5,61.75 52.5,62.75 LED7.9 | 77.6,61.65 77.5,62.75 LED8.9 | LED7.4 65.75,61.35 72.7,61.3 73.9,62.2 74.7,62 75.1,60.9 78.71,60.85
  Bottom 0.305: LED5.9 2.5,62.35 3,60.45 15.1,60.35 15.1,62.75 LED5.4 | LED6.9 27.45,62.45 27.45,60.35 39.4,60.35 40.1,62.45 | 77.6,61.65 78.71,60.85 89.3,60.85 90.1,61.95 LED8.4 | LED6.4 40.15,62.65 40.75,61.55 48.5,61.75 49.5,62.75 52.25,62.75 LED7.9
SEGE-1  (via drill 0.61)
  Top 0.152: 29.4,54.85 29.45,54.5 IC2.21 | 62.75,42.25 LED3.5 | 72.85,42.25 LED3.1
  Top 0.305: 29.4,54.85 29.3,55.6 28.25,56.25 23,56.25 v20.8,46.1 21.8,43.25 LED1.1 | LED4.5 87.55,43.25 89.3,46 97.75,46 97.75,42.25 LED4.1 | v12.55,45.8 12.55,42.45 LED1.5 | v48,45.7 47.7,42.3 47.75,42.25 LED2.1
  Top 0.406: 62.75,42.25 v65.75,45.75 66.24,46.12 arc-63 68.22,47.35 71.5,47.35 arc-90 72.85,46 72.85,42.25
  Bottom 0.152: 37.5,42.25 LED2.5 | 97.75,42.25 LED4.1 | 48.15,45.65 v48,45.7
  Bottom 0.305: v12.55,45.8 14.35,45.8 v20.8,46.1 23.15,45.7 28.9,45.25 35.6,44.75 37.5,43.45 | 37.5,42.25 37.5,43.45 | 37.5,43.45 41.65,44.15 44.75,45.35 48.15,45.65 v65.75,45.75 82.9,47.45 94.85,46.7 96.7,44.9 97.75,42.25
SEGE-2  (via drill 0.61)
  Top 0.152: 73.75,65.5 IC3.21 | 62.5,62.75 LED7.5 62.5,62.9 | 22.75,62.75 LED5.1 | 37.5,63 LED6.5 37.75,63
  Top 0.305: 73.75,65.5 73.75,63.6 73.25,63.25 73,63 LED7.1 73,62.75 73.35,61.9 v73.75,61 | v62.5,60 62.5,62.75 | LED8.5 87.61,62.66 arc34 88.02,61.57 arc52 89.8,60.7 96.55,60.7 arc90 97.75,61.9 97.75,62.75 LED8.1 | 22.75,62.75 22.75,61.35 19.75,61.35 19.56,61.44 arc-45 19,63.01 19,63.47 arc90 17.82,64.65 14.06,64.65 arc63 12.95,63.98 12.55,63.2 LED5.5 | 37.5,63 37.5,64.63 arc90 34.03,68.1 24.19,68.1 arc90 22.7,65.31 22.7,63 LED5.1 | 37.75,63 37.75,64.4 41.2,64.5 41.9,64.9 43.2,66.5 43.45,67.85 43.45,75.8 43.7,76.15 44.1,76.45 47.75,76.45 48.75,75.45 v48.75,65.25 48.75,63.75 48,63 LED6.1 | 62.5,62.9 61.05,64.75 v60.85,65.25
  Bottom 0.152: 97.75,62.75 LED8.1 | v48.75,65.25 v60.85,65.25
  Bottom 0.254: v62.5,60 62.75,59.75 73.75,59.75 | 73.75,59.75 94.75,59.75 97.75,62.75 | 73.75,59.75 v73.75,61
SEGF-1  (via drill 0.61)
  Top 0.152: v36,58.25 36,57.25 37,56.25 37,54.5 IC2.15 | 47.75,57.5 LED2.18
  Top 0.254: LED3.12 57.5,57.25 57.62,56.39 arc33 58.12,55.26 58.6,54.7 59.58,54.04 arc41 60.84,53.73 67.77,54.59 arc83 69.05,56.04 69.05,57.81 arc-65 69.45,58.44 70,58.7 71.94,58.7 arc-90 72.85,57.89 72.85,57.5 LED3.18
  Top 0.305: v47.6,59.35 47.75,57.5
  Bottom 0.152: 73,57.5 LED3.18 72.75,57.5 70.9,59.15 v47.6,59.35 | 35.75,58.5 v36,58.25 | 32.3,57.6 LED2.12
  Bottom 0.305: 82.25,58.7 82.25,57.5 LED4.12 | 82.25,58.7 74,58.6 73,57.5 | 82.25,58.7 96.75,58.6 97.75,57.5 LED4.18 | LED1.12 7.3,58.2 8.5,58.7 21.75,58.7 22.75,58.2 LED1.18 22.8,58.1 24,58.7 32.4,58.7 | 32.4,58.7 35.75,58.5 | 32.3,57.6 32.4,58.7 | v47.6,59.35 45.45,59.2 36.75,59.2 v36,58.25
SEGF-2  (via drill 0.61)
  Top 0.152: 66.25,65.75 IC3.15
  Top 0.305: LED7.12 58.55,77.4 58.25,69.05 v58,69.35 | v66.25,69 66.25,65.75
  Bottom 0.152: 97.75,78 LED8.18 | v58,69.35 61.25,69 v66.25,69
  Bottom 0.254: LED7.12 56.8,79.4 48.3,79.4 LED6.18 47.3,79.4 33,79.4 LED6.12 32,79.3 23.3,79.3 LED5.18 22.5,79.3 8,79.3 LED5.12
  Bottom 0.305: LED7.12 57.8,79.3 72.2,79.4 LED7.18 73.3,79.3 82.2,79.3 LED8.12 83.1,79.3 97.7,79.4 LED8.18
SEGG-1  (via drill 0.61)
  Top 0.152: 34.6,54 34.75,54.25 IC2.17 | 36.5,49.1 36.5,43.65 36,43.25 33.05,43.15 32.55,42.65 LED2.7 | 57.75,42.25 LED3.7 | 70.35,54.65 70.25,54.5 | 82.5,42.25 LED4.7
  Top 0.305: 34.6,54 34.7,50.7 34.7,50.1 | 36.5,49.1 34.7,50.1 | 15.15,49.05 20,54.5 20.2,56.95 LED1.17 | 15.15,49.05 7.45,49.05 LED1.7 | 15.15,49.05 v15.25,44.25 | v45.5,55.4 45.3,56.4 45.25,57.25 LED2.17 | v34.15,49.45 34.7,50.1
  Top 0.406: 63.25,47.75 70.35,54.65 70.35,57.15 LED3.17 | 63.25,47.75 57.75,42.25 | 70.25,54.5 81.25,43.5 | 81.25,43.5 82.5,42.25 | 63.25,47.75 58.5,52.5 | 58.5,52.5 v58,53.5 | 81.25,43.5 95,57.25 LED4.17 | 58.5,52.5 v58.45,49.55
  Bottom 0.152: 32.5,42.25 LED2.7
  Bottom 0.254: v45.5,55.4 48.5,55 v58,53.5 | v58.45,49.55 v34.15,49.45
  Bottom 0.305: 32.5,42.25 31,44.15 v15.25,44.25
SEGG-2  (via drill 0.61)
  Top 0.152: 68.75,65.75 IC3.17 | v71.95,70.15 72,71 72,76.25 70.25,78 LED7.17 | 32.5,62.75 LED6.7
  Top 0.305: v68.85,70.15 v68.75,67.5 68.75,65.75 | v57.5,66 57.5,63 LED7.7 | v88.75,70.5 84.75,66.6 82.55,65 LED8.7 | 14.15,69.4 19.04,74.29 arc45 20.2,76.3 20.2,77.3 LED5.17 | 14.15,69.4 7.75,63 LED5.7 7.55,62.75 7.55,61.66 arc90 8.86,59.85 28.4,59.85 29.9,61.35 31.7,61.85 32.5,62.75 | 42.4,68.4 42.55,69.15 42.55,76.35 45,78 LED6.17 | 14.15,69.4 42.4,68.4 | v41.05,66 42,67.35 42.4,68.4
  Bottom 0.152: v68.85,70.15 69.1,70.2 71.45,70.1 v71.95,70.15 | v41.05,66 v57.5,66
  Bottom 0.254: v88.75,70.5 71.45,70.1 | v57.5,66 67.25,66 v68.75,67.5
  Bottom 0.305: v88.75,70.5 91.8,71 95.2,76.6 LED8.17
VCC
  Top 0.152: 27,10.75 IC5.3 | 18.75,9.5 D1.C | 22,4.5 C9.+
  Top 0.61: 27,10.75 28.05,10 28.05,2.35 27.25,1.45 22.25,1.45 22.25,4.25
  Top 0.813: 22.25,4.25 C9.+ | 18.75,9.5 22,6.25 22,4.5
  Bottom 0.152: 34.5,9.5 34.75,9.25 JP3.1 | 18.75,9.5 D1.C
  Bottom 0.813: 18.75,9.5 34.5,9.5
VSEL
  Top 0.152: 88.75,6 RC2.2 | 84,3 X12.1 | 65.5,5.75 RC1.2
  Top 0.406: 88.75,6 85.7,4 84,3 | RC1.2 arc-90 62.66,3 X7.1
  Bottom 0.152: 65.2,0.55 65,0.55 | 35,6.5 JP3.2 | 84,3 X12.1
  Bottom 0.406: 56.26,0.55 65,0.55
  Bottom 0.61: 35,6.5 37.8,6.6 40.95,0.55 65,0.55 | 65.2,0.55 69.55,0.6 83.5,0.6 84,3 | X7.1 arc90 56.26,0.55

### Text on the board
tNames: guillem bayo / abril-2017 | % / parasit